# Altium schematic sheet Relay2_Block.SchDoc
size A4; CheckedBy: CT-Energys; Author: CT-Energys; CompanyName: HTD COMPANY LIMITED; DrawnBy: CHITOAN; Engineer: CHITOAN; Organization: Altium Limited; Address1: HO CHI MINH CITY; Address2: VIETNAM
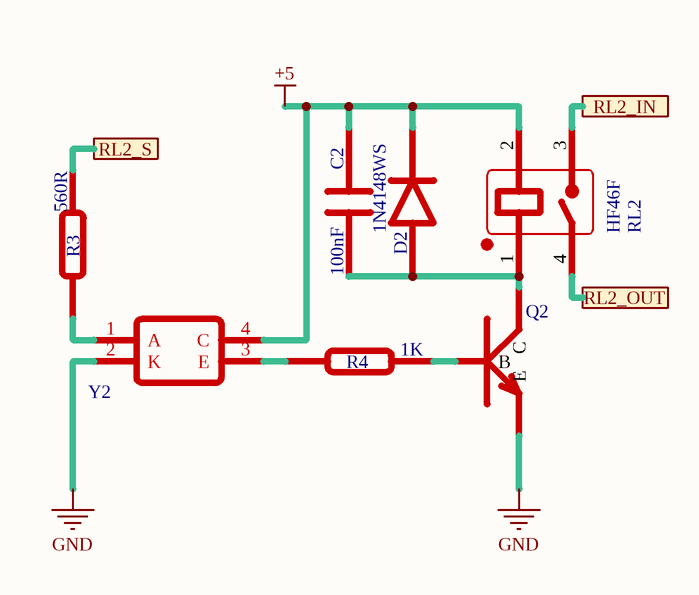
[diagram p0: Relay2_Block.SchDoc]

## Parts
C2  100nF  [C0805]
D2  1N4148WS  [SMA]
Q2  S8050  [SOT-23]  (value not drawn)
R3  560R  [R0603]
R4  1K  [R0603]
RL2  HF46F  [HF-46-X]
Y2  PHOTOCOUPLER  [SOP-4]  (value not drawn)

## Ports
RL2_IN, RL2_OUT, RL2_S

## Nets
+5: C2.2 D2.K RL2.2 Y2.4(C)
GND: Q2.2(E) Y2.2(K)
RL2_IN: RL2.3 ; port RL2_IN
RL2_OUT: RL2.4 ; port RL2_OUT
RL2_S: R3.1 ; port RL2_S
NetC2_1: C2.1 D2.A Q2.3(C) RL2.1
NetQ2_1: Q2.1(B) R4.1
NetR3_2: R3.2 Y2.1(A)
NetR4_2: R4.2 Y2.3(E)

## Notes on the sheet
- Title
- Size:
- Date:
- A4
- Number:
- Time:
- Revision:
- Design by:
- Company:
- File:

## Library data of the parts
C2 = CAP-CER: Ceramic Capacitor
D2 = 1N4148WS: Small Signal Diode
Q2 = S8050: NPN Transistors 0.5A Collector to Emitter 25V
R3 R4 = Resistor
RL2 = HF46F: Relay 4 Pin; ComponentLink1Description: HF-46F; ComponentLink1URL: https://source.hongfa.com/pdf/web/viewer.html?file=/Uploads/Product/PDF/HF46F_en.pdf
Y2 = PC817: Photo-Coupler; ComponentLink1Description: PC817; ComponentLink1URL: https://www.socle-tech.com/doc/IC%20Channel%20Product/Optoelectronic%20Components/Photocoupler/PC8171_NIP1B_ED-16P023.pdf